# Altium project NixieClock_Controller.PrjPCB
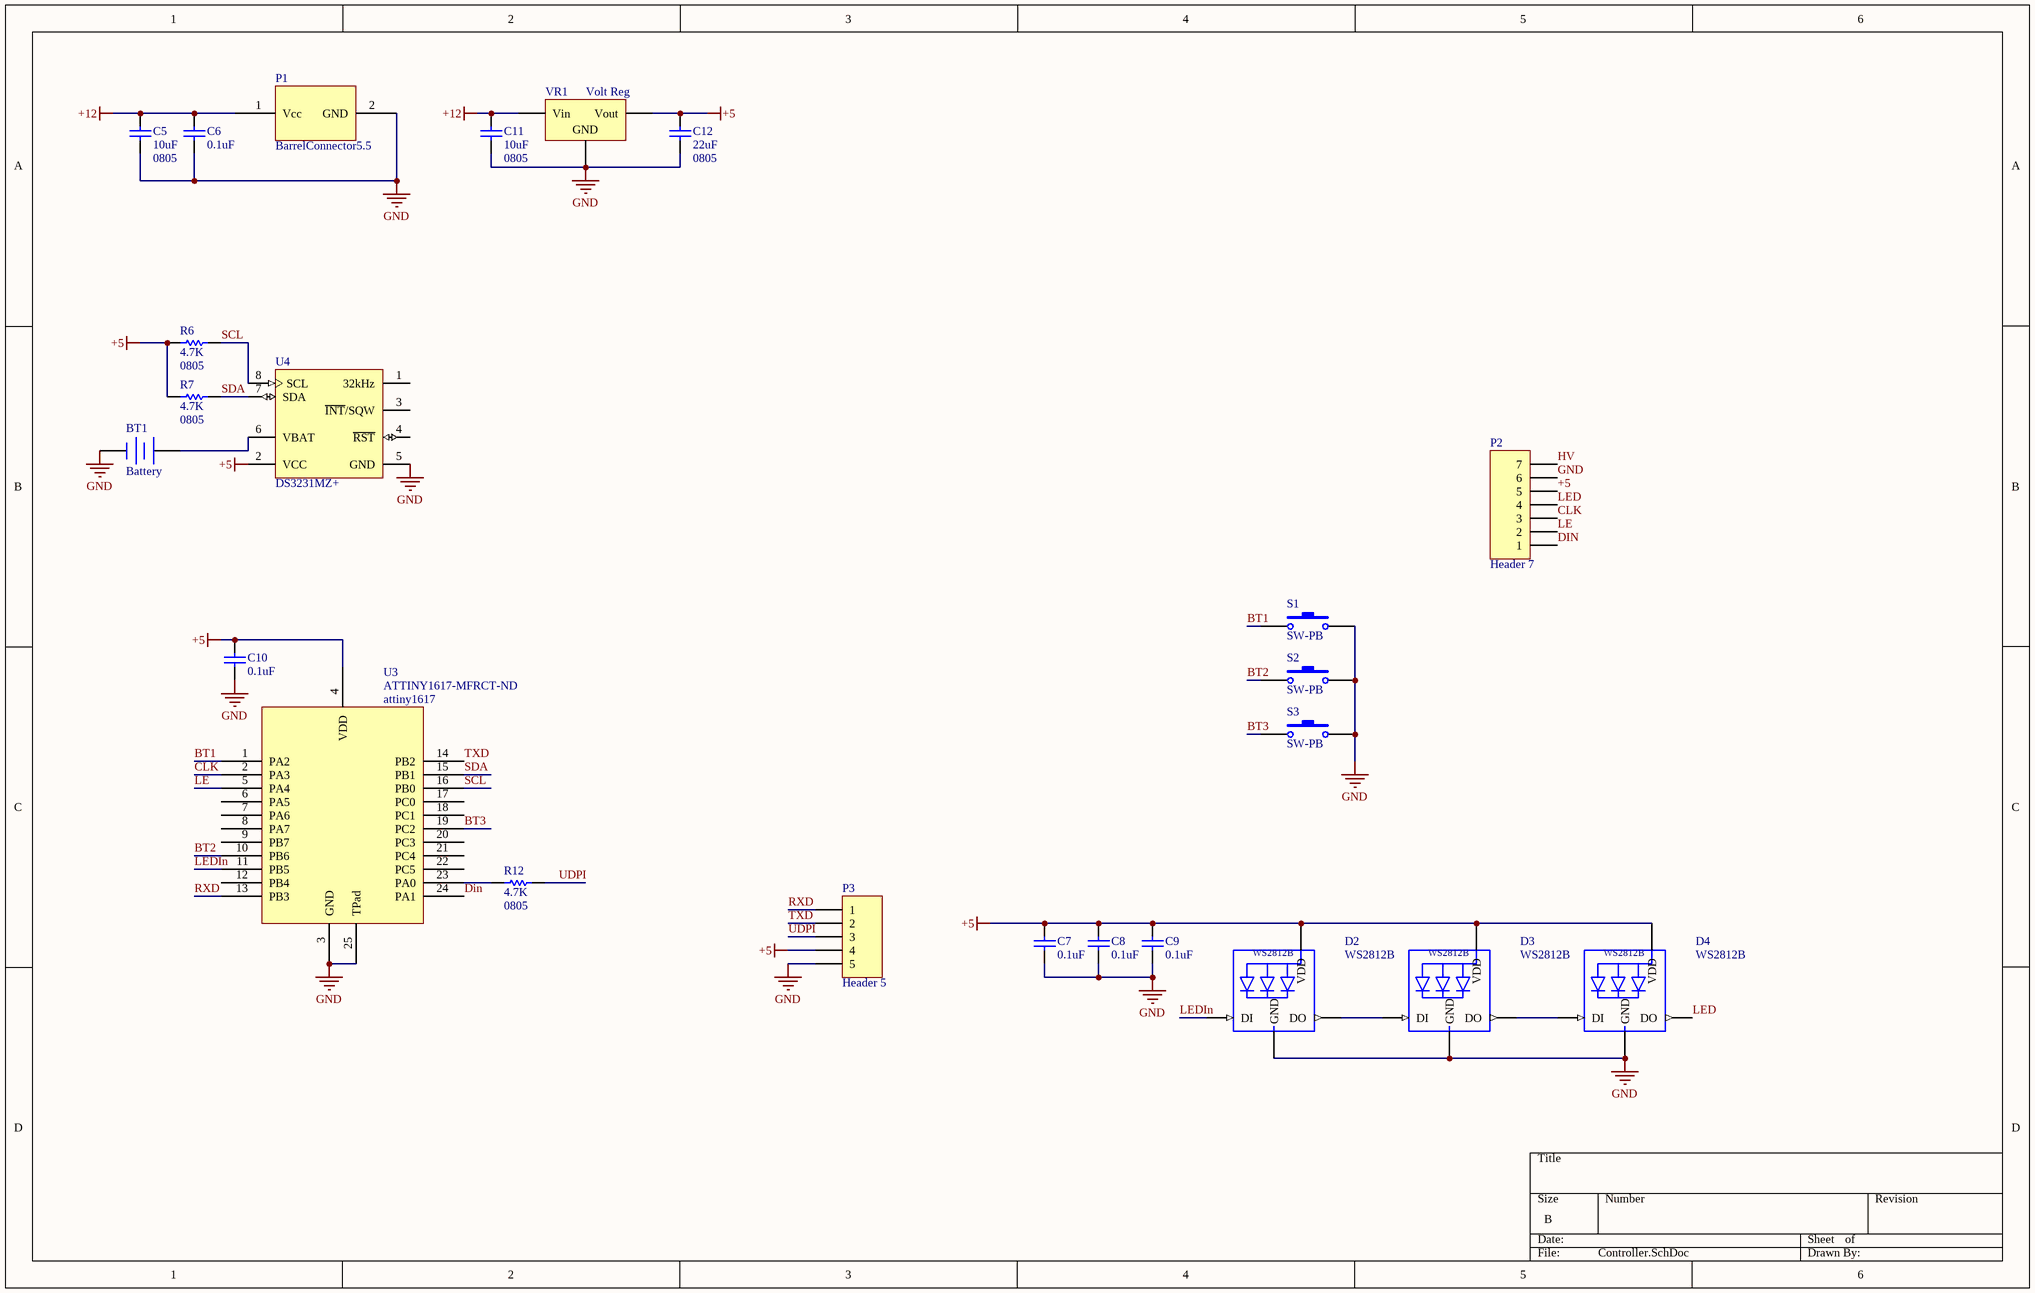
[diagram p0: Controller.SchDoc]
2 sheets, 37 parts. Net scope: global (net labels, ports and power ports of the same name join across sheets).
Board file: Controller.PcbDoc
Sheets:
  Controller.SchDoc
  BoostConverter.SchDoc

## Sheet Controller.SchDoc: Controller
size B; DrawnBy: Benjamin Dyer; Revision: 2.1; SheetNumber: 1; SheetTotal: 1

### Parts
BT1  Battery  [1048P_KEY]
C5  10uF  value 0805  [6-0805_M]
C6  0.1uF  [6-0805_M]
C7  0.1uF  [1608[0603]]
C8  0.1uF  [1608[0603]]
C9  0.1uF  [1608[0603]]
C10  0.1uF  [6-0805_N]
C11  10uF  value 0805  [6-0805_M]
C12  22uF  value 0805  [6-0805_M]
D2  WS2812B  [WS2812B-NARROW]
D3  WS2812B  [WS2812B-NARROW]
D4  WS2812B  [WS2812B-NARROW]
P1  BarrelConnector5.5  [BarrelConnector5.5]
P2  Header 7  [HDR1X7]
P3  Header 5  [HDR1X5]
R6  4.7K  value 0805  [6-0805_M]
R7  4.7K  value 0805  [6-0805_M]
R12  4.7K  value 0805  [6-0805_N]
S1  SW-PB  [Button2]
S2  SW-PB  [Button2]
S3  SW-PB  [Button2]
U3  attiny1617  Supplier Part Number 1: ATTINY1617-MFRCT-ND  [Quad24 - 1617]
U4  DS3231MZ+  [SO8_N]
VR1  Volt Reg  [SOT223_N]

### Nets
+5: C7.2 C8.2 C9.2 C10.2 C12.2 D2.1-VDD(VDD) D3.1-VDD(VDD) D4.1-VDD(VDD) P2.5 P3.4 R6.2 R7.2 U3.4(VDD) U4.2(VCC) VR1.3(Vout)
+12: C5.2 C6.2 C11.2 P1.1(Vcc) VR1.1(Vin)
GND: BT1.2(-) C5.1 C6.1 C7.1 C8.1 C9.1 C10.1 C11.1 C12.1 D2.3-GND(GND) D3.3-GND(GND) D4.3-GND(GND) P1.2(GND) P2.6 P3.5 S1.2 S2.2 S3.2 U3.3(GND) U3.25(TPad) U4.5(GND) VR1.2(GND)
HV: P2.7
BT1: S1.1 U3.1(PA2)
BT2: S2.1 U3.10(PB6)
BT3: S3.1 U3.19(PC2)
CLK: P2.3 U3.2(PA3)
Din: P2.1 U3.24(PA1)
LE: P2.2 U3.5(PA4)
LED: D4.2-DOUT(DO) P2.4
LEDIn: D2.4-DIN(DI) U3.11(PB5)
RXD: P3.1 U3.13(PB3)
SCL: R6.1 U3.16(PB0) U4.8(SCL)
SDA: R7.1 U3.15(PB1) U4.7(SDA)
TXD: P3.2 U3.14(PB2)
UDPI: P3.3 R12.2
NetBT1_1: BT1.1(+) U4.6(VBAT)
NetD2_2-DOUT: D2.2-DOUT(DO) D3.4-DIN(DI)
NetD3_2-DOUT: D3.2-DOUT(DO) D4.4-DIN(DI)
NetR12_1: R12.1 U3.23(PA0)

Not connected (* = marked no-connect by the designer): U3 6(PA5) 7(PA6) 8(PA7) 9(PB7) 12(PB4) 17(PC0) 18(PC1) 20(PC3) 21(PC4) 22(PC5); U4 1(32kHz) 3(~{INT}/SQW) 4(~{RST})

### Library data of the parts
BT1 = Battery: Multicell Battery; Published: 24-Mar-1999; LatestRevisionDate: 17-Jul-2002; LatestRevisionNote: Re-released for DXP Platform.; PackageReference: BAT-2; Publisher: Altium Limited; PackageDescription: Battery; 2 Leads
C5-C12 = Cap: Capacitor; Published: 8-Jun-2000; LatestRevisionDate: 17-Jul-2002; LatestRevisionNote: Re-released for DXP Platform.; PackageReference: RAD-0.3; Publisher: Altium Limited; PackageDescription: Radial Cap, Thru-Hole; 2 Leads; 0.3 in Pin Spacing
D2-D4 = WS2812B: Raspberry Pi HAT _40 pin_ Wheeled Robotics Kit; MF: SparkFun Electronics; Availability: Unavailable; SnapEDA_Link: https://www.snapeda.com/parts/WS2812B/Worldsemi/view-part/1038297/?ref=snap; MP: WS2812B; Price: None; Value: *; Package: None; Supplier 1: Digi-Key; Supplier Part Number 1: 1528-1104-ND
P2 = Header 7: Header, 7-Pin; LatestRevisionDate: 17-Jul-2002; LatestRevisionNote: Re-released for DXP Platform.; Publisher: Altium Limited
P3 = Header 5: Header, 5-Pin; LatestRevisionDate: 17-Jul-2002; LatestRevisionNote: Re-released for DXP Platform.; Publisher: Altium Limited
R6 R7 R12 = Res1: Resistor; Published: 8-Jun-2000; LatestRevisionDate: 17-Jul-2002; LatestRevisionNote: Re-released for DXP Platform.; PackageReference: AXIAL-0.3; Publisher: Altium Limited; PackageDescription: Axial Device, Thru-Hole; 2 Leads; 0.3 in Pin Spacing
S1-S3 = SW-PB: Switch; Published: 24-Mar-1999; LatestRevisionDate: 17-Jul-2002; LatestRevisionNote: Re-released for DXP Platform.; PackageReference: SPST-2; Publisher: Altium Limited; PackageDescription: Switch; 2 Leads
U4 = DS3232MZ+: +/-5ppm, I2C Real-Time Clock with Internal MEMs Resonator and SRAM, 8-Pin SO, -40 to 85 degC, Pb-Free; DatasheetVersion: Rev 0, Mar-2012; PackageVersion: revC, 2010; PackageReference: S8MK+1; PackageDescription: 8-Pin Small-Outline IC, Narrow (0.15in), 1.27 mm Pitch, SOIC (N), Pb-Free; Code_JEDEC: MS-012-AA; Code_IPC: SOIC127P600-8; ComponentLink1Description: Manufacturer URL; ComponentLink1URL: http://www.maxim-ic.com; ComponentLink2Description: Datasheet; ComponentLink2URL: http://datasheets.maxim-ic.com/en/ds/DS3232M.pdf; ComponentLink3Description: Package Specification; ComponentLink3URL: http://pdfserv.maxim-ic.com/package_dwgs/21-0041.PDF; Supplier 1: Digi-Key; Supplier Part Number 1: DS3231MZ+-ND
VR1 = Volt Reg: Voltage Regulator; pin to pad: 1>3 2>1 3>2; Published: 24-Mar-1999; LatestRevisionDate: 29-May-2009; LatestRevisionNote: IPC-7351 Footprint Added.; PackageReference: D2PAK; Publisher: Altium Limited; PackageDescription: 3-Pin Transistor Outline Package 2.54 mm Pitch, 15.1 mm Lead Span
P1 = BarrelConnector5.5: Supplier 1: Digi-Key; Supplier Part Number 1: CP-037A-ND
U3 = attiny1617: Supplier 1: Digi-Key

## Sheet BoostConverter.SchDoc
size A4
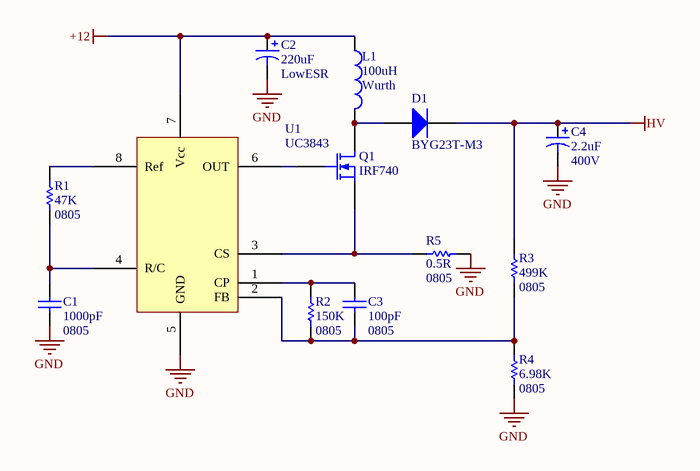
[diagram p1: BoostConverter.SchDoc]

### Parts
C1  1000pF  value 0805  [6-0805_N]
C2  220uF  value LowESR  [CapacitorxNichicon]
C3  100pF  value 0805  [6-0805_N]
C4  2.2uF  value 400V  [CAP_UCD_10X10_NCH]
D1  BYG23T-M3  [DIODE_SMA_DO-214AC_VIS]
L1  100uH  value Wurth  [inductor12mm]
Q1  IRF740  [D2PAK_L]
R1  47K  value 0805  [6-0805_N]
R2  150K  value 0805  [6-0805_N]
R3  499K  value 0805  [6-0805_N]
R4  6.98K  value 0805  [6-0805_N]
R5  0.5R  value 0805  [6-0805_N]
U1  UC3843  [UC3843BD1]

### Nets
+12: C2.1 L1.1 U1.7(Vcc)
GND: C1.1 C2.2 C4.2 R4.1 R5.1 U1.5(GND)
HV: C4.1 D1.2(K) R3.2
NetC1_2: C1.2 R1.1 U1.4(R/C)
NetC3_1: C3.1 R2.1 R3.1 R4.2 U1.2(FB)
NetC3_2: C3.2 R2.2 U1.1(CP)
NetD1_1: D1.1(A) L1.2 Q1.1(D)
NetQ1_2: Q1.2(G) U1.6(OUT)
NetQ1_3: Q1.3(S) R5.2 U1.3(CS)
NetR1_2: R1.2 U1.8(Ref)

### Library data of the parts
C1 C3 = Cap: Capacitor; Published: 8-Jun-2000; LatestRevisionDate: 17-Jul-2002; LatestRevisionNote: Re-released for DXP Platform.; PackageReference: RAD-0.3; Publisher: Altium Limited; PackageDescription: Radial Cap, Thru-Hole; 2 Leads; 0.3 in Pin Spacing
C2 = Cap Pol1: Polarized Capacitor (Radial); pin to pad: 1>2 2>1; Published: 8-Jun-2000; LatestRevisionDate: 17-Jul-2002; LatestRevisionNote: Re-released for DXP Platform.; PackageReference: RB7.6-15; Publisher: Altium Limited; PackageDescription: Polarized Capacitor (Radial); 2 Leads; Supplier 1: Digi-Key
C4 = Cap Pol1: Polarized Capacitor (Radial); Published: 8-Jun-2000; LatestRevisionDate: 17-Jul-2002; LatestRevisionNote: Re-released for DXP Platform.; PackageReference: RB7.6-15; Publisher: Altium Limited; PackageDescription: Polarized Capacitor (Radial); 2 Leads; Supplier 1: Digi-Key; Supplier Part Number 1: 493-9969-1-ND
D1 = Diode: Default Diode; pin to pad: 1>2 2>1; Published: 8-Jun-2000; LatestRevisionDate: 17-Jul-2002; LatestRevisionNote: Re-released for DXP Platform.; PackageVersion: Sep-1996; PackageReference: SMC; Publisher: Altium Limited; PackageDescription: DO-214-AB/SMC; 2 C-Bend Leads; Body 7.9 x 5.9 mm, inc. leads (LxW); Code_JEDEC: DO-214-AB; Supplier 1: Digi-Key; Supplier Part Number 1: BYG23T-M3/CT-ND
L1 = Inductor: Code_IEC: 1005; Published: 8-Jun-2000; LatestRevisionDate: 29-May-2009; LatestRevisionNote: IPC-7351 Footprint Added.; PackageReference: 0402-A; Publisher: Altium Limited; PackageDescription: Chip Inductor; Code_JEITA: 0402; Supplier 1: Digi-Key; Supplier Part Number 1: 732-1235-1-ND
Q1 = MOSFET-N: N-Channel MOSFET; pin to pad: 1>2 2>1; Published: 8-Jun-2000; LatestRevisionDate: 17-Jul-2002; LatestRevisionNote: Re-released for DXP Platform.; PackageVersion: 1995/1996; PackageReference: E3; Publisher: Altium Limited; PackageDescription: TO, Flat Index; 3 In-Line, Axial Leads; Body Dia. 4.6mm; Lead Dia. 0.5 mm (max); Supplier 1: Digi-Key; Supplier Part Number 1: IRF740SPBF-ND
R1-R5 = Res1: Resistor; Published: 8-Jun-2000; LatestRevisionDate: 17-Jul-2002; LatestRevisionNote: Re-released for DXP Platform.; PackageReference: AXIAL-0.3; Publisher: Altium Limited; PackageDescription: Axial Device, Thru-Hole; 2 Leads; 0.3 in Pin Spacing

## Nets that join several sheets
+12: Controller (5 pins), BoostConverter (C2.1 L1.1 U1.7)
GND: Controller (22 pins), BoostConverter (6 pins)
HV: Controller (P2.7), BoostConverter (C4.1 D1.2 R3.2)